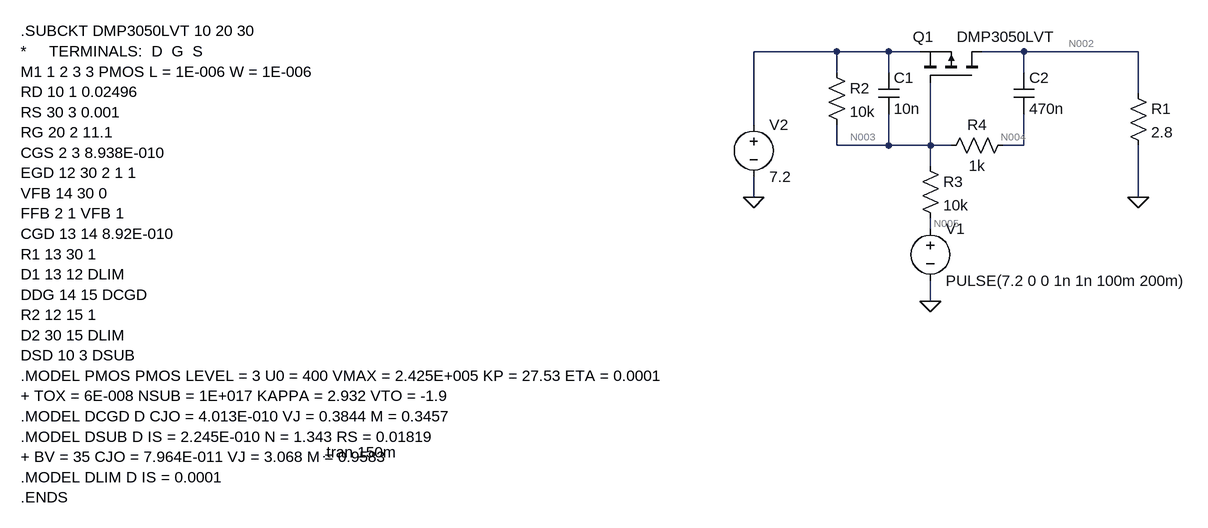
[diagram p0: schematic tec-softstart-LTspice-XVII.asc]
tec-softstart-LTspice-XVII.asc, the LTspice schematic file:
Version 4
SHEET 1 880 680
WIRE 304 -80 176 -80
WIRE 384 -80 304 -80
WIRE 432 -80 384 -80
WIRE 592 -80 528 -80
WIRE 768 -80 592 -80
WIRE 304 -48 304 -80
WIRE 384 -48 384 -80
WIRE 592 -48 592 -80
WIRE 768 -16 768 -80
WIRE 176 32 176 -80
WIRE 304 64 304 32
WIRE 384 64 384 16
WIRE 384 64 304 64
WIRE 448 64 448 -32
WIRE 448 64 384 64
WIRE 480 64 448 64
WIRE 592 64 592 16
WIRE 592 64 560 64
WIRE 448 96 448 64
WIRE 176 144 176 112
WIRE 768 144 768 64
WIRE 448 192 448 176
WIRE 448 304 448 272
FLAG 176 144 0
FLAG 448 304 0
FLAG 768 144 0
SYMBOL pmos 528 -32 M270
WINDOW 0 71 107 VLeft 2
WINDOW 3 71 39 VLeft 2
SYMATTR InstName Q1
SYMATTR Value DMP3050LVT
SYMATTR Prefix X
SYMBOL voltage 448 176 R0
WINDOW 123 0 0 Left 0
WINDOW 39 0 0 Left 0
SYMATTR InstName V1
SYMATTR Value PULSE(7.2 0 0 1n 1n 100m 200m)
SYMBOL voltage 176 16 R0
WINDOW 123 0 0 Left 0
WINDOW 39 0 0 Left 0
SYMATTR InstName V2
SYMATTR Value 7.2
SYMBOL res 752 -32 R0
SYMATTR InstName R1
SYMATTR Value 2.8
SYMBOL res 288 -64 R0
SYMATTR InstName R2
SYMATTR Value 10k
SYMBOL cap 368 -48 R0
SYMATTR InstName C1
SYMATTR Value 10n
SYMBOL res 432 80 R0
SYMATTR InstName R3
SYMATTR Value 10k
SYMBOL cap 576 -48 R0
SYMATTR InstName C2
SYMATTR Value 470n
SYMBOL res 576 48 R90
WINDOW 0 0 56 VBottom 2
WINDOW 3 32 56 VTop 2
SYMATTR InstName R4
SYMATTR Value 1k
TEXT -952 -112 Left 2 !.SUBCKT DMP3050LVT 10 20 30 \n*     TERMINALS:  D  G  S\nM1 1 2 3 3 PMOS L = 1E-006 W = 1E-006 \nRD 10 1 0.02496 \nRS 30 3 0.001 \nRG 20 2 11.1 \nCGS 2 3 8.938E-010 \nEGD 12 30 2 1 1 \nVFB 14 30 0 \nFFB 2 1 VFB 1 \nCGD 13 14 8.92E-010 \nR1 13 30 1 \nD1 13 12 DLIM \nDDG 14 15 DCGD \nR2 12 15 1 \nD2 30 15 DLIM \nDSD 10 3 DSUB \n.MODEL PMOS PMOS LEVEL = 3 U0 = 400 VMAX = 2.425E+005 KP = 27.53 ETA = 0.0001 \n+ TOX = 6E-008 NSUB = 1E+017 KAPPA = 2.932 VTO = -1.9 \n.MODEL DCGD D CJO = 4.013E-010 VJ = 0.3844 M = 0.3457 \n.MODEL DSUB D IS = 2.245E-010 N = 1.343 RS = 0.01819 \n+ BV = 35 CJO = 7.964E-011 VJ = 3.068 M = 0.9583 \n.MODEL DLIM D IS = 0.0001 \n.ENDS
TEXT -488 536 Left 2 !.tran 150m

The netlist it stands for:
* tec-softstart-LTspice-XVII.asc
XQ1 N002 N003 N001 DMP3050LVT  ; pins D G S
V1 N005 0 PULSE(7.2 0 0 1n 1n 100m 200m)
V2 N001 0 7.2
R1 N002 0 2.8
R2 N001 N003 10k
C1 N001 N003 10n
R3 N003 N005 10k
C2 N002 N004 470n
R4 N004 N003 1k
.SUBCKT DMP3050LVT 10 20 30
*     TERMINALS:  D  G  S
M1 1 2 3 3 PMOS L = 1E-006 W = 1E-006
RD 10 1 0.02496
RS 30 3 0.001
RG 20 2 11.1
CGS 2 3 8.938E-010
EGD 12 30 2 1 1
VFB 14 30 0
FFB 2 1 VFB 1
CGD 13 14 8.92E-010
R1 13 30 1
D1 13 12 DLIM
DDG 14 15 DCGD
R2 12 15 1
D2 30 15 DLIM
DSD 10 3 DSUB
.MODEL PMOS PMOS LEVEL = 3 U0 = 400 VMAX = 2.425E+005 KP = 27.53 ETA = 0.0001
+ TOX = 6E-008 NSUB = 1E+017 KAPPA = 2.932 VTO = -1.9
.MODEL DCGD D CJO = 4.013E-010 VJ = 0.3844 M = 0.3457
.MODEL DSUB D IS = 2.245E-010 N = 1.343 RS = 0.01819
+ BV = 35 CJO = 7.964E-011 VJ = 3.068 M = 0.9583
.MODEL DLIM D IS = 0.0001
.ENDS
.tran 150m
.backanno
.end

* Results of the author's LTspice run, read from the files saved beside the schematic
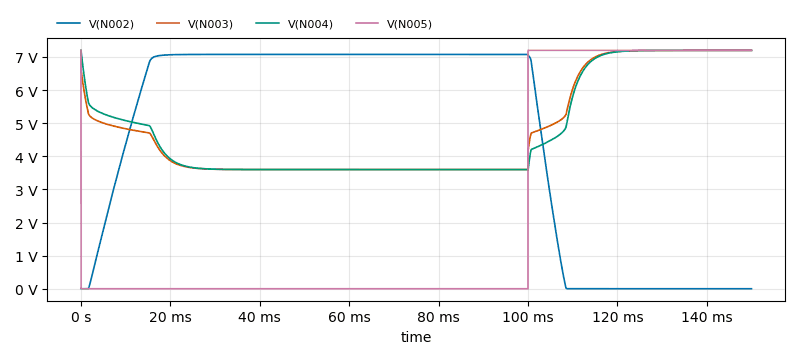
[diagram p1: Transient Analysis of tec-softstart-LTspice-XVII.asc, plotted from the saved traces]
* Transient Analysis, 1 run:
*   V(N002): min -1.624 mV, max 7.078 V, average 4.518 V, rms 5.545 V, last 3.24 µV
*   V(N003): min 3.6 V, max 7.2 V, average 4.8 V, rms 5.028 V, last 7.2 V
*   V(N004): min 3.586 V, max 7.2 V, average 4.8 V, rms 5.029 V, last 7.2 V
*   V(N005): min 0 V, max 7.2 V, average 2.4 V, rms 4.157 V, last 7.2 V